# Altium schematic sheet yhh.SchDoc
size A3; DrawnBy: YHJ
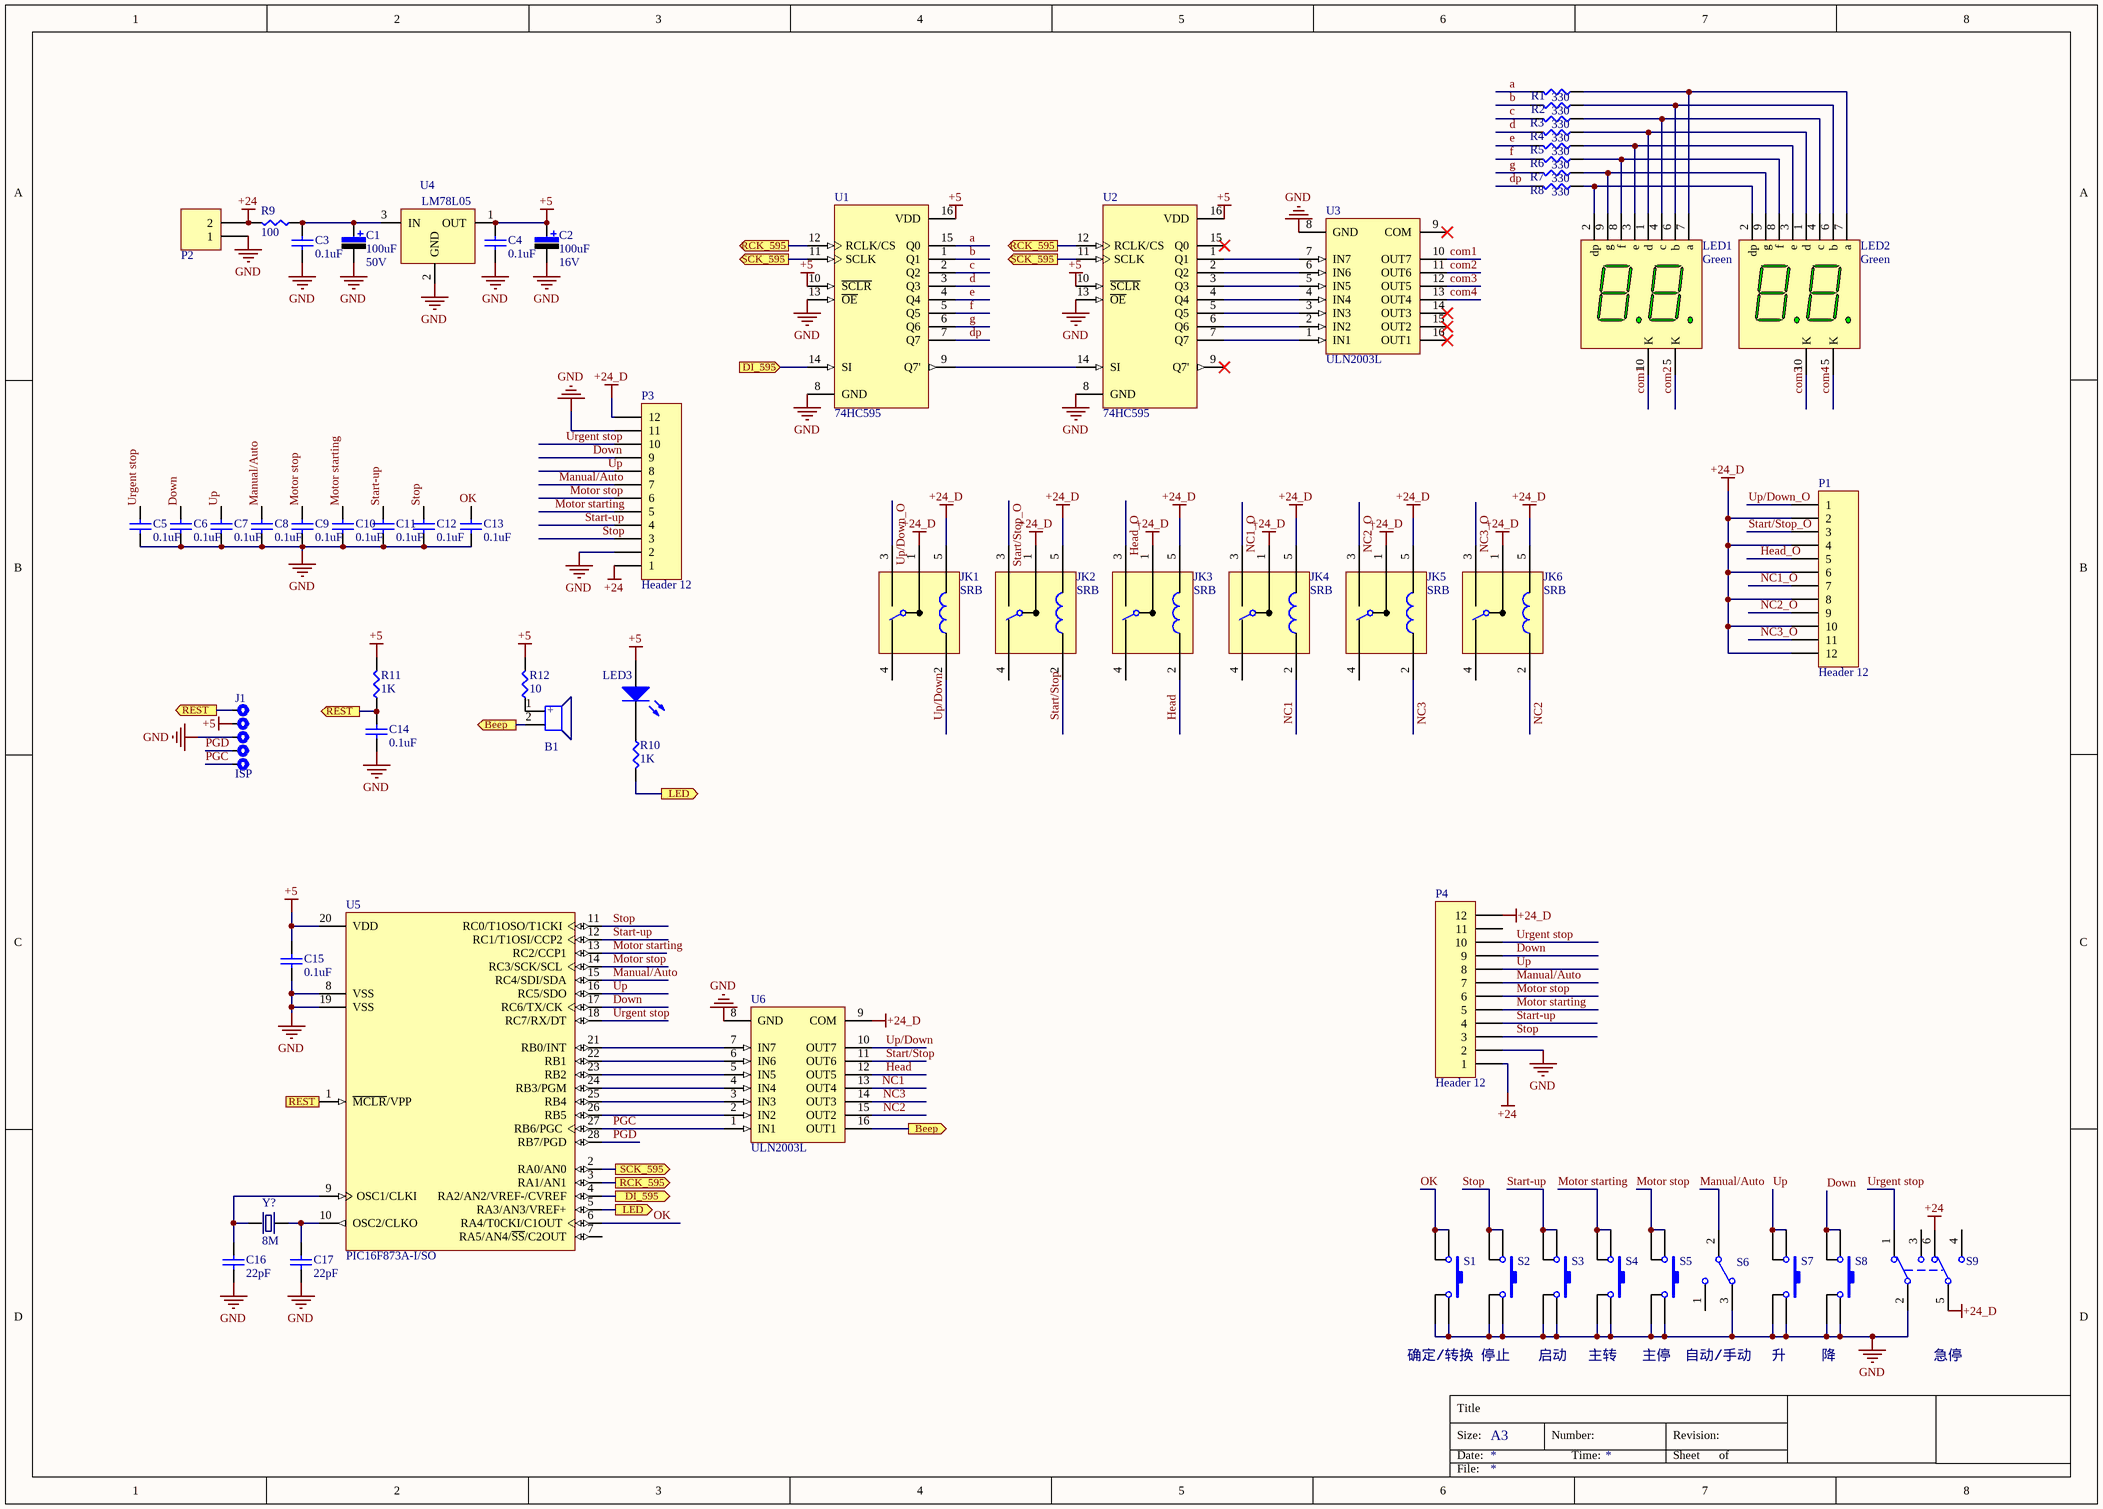
[diagram p0: yhh.SchDoc]

## Parts
B1  BEEP  [BUZZ]  (value not drawn)
C1  value 100uF  Vol: 50V  [CAL6.3x8]  (hidden comment: Cap Pol)
C2  value 100uF  Vol: 16V  [TA3216]  (hidden comment: Cap Pol)
C3  0.1uF  [C0805(2012)]
C4  0.1uF  [C0805(2012)]
C5  0.1uF  [C0805(2012)]
C6  0.1uF  [C0805(2012)]
C7  0.1uF  [C0805(2012)]
C8  0.1uF  [C0805(2012)]
C9  0.1uF  [C0805(2012)]
C10  0.1uF  [C0805(2012)]
C11  0.1uF  [C0805(2012)]
C12  0.1uF  [C0805(2012)]
C13  0.1uF  [C0805(2012)]
C14  0.1uF  [C0805(2012)]
C15  0.1uF  [C0805(2012)]
C16  22pF  [C0805(2012)]
C17  22pF  [C0805(2012)]
J1  ISP  [HDR1X6]
JK1  SRB  [RELAY_SRA]
JK2  SRB  [RELAY_SRA]
JK3  SRB  [RELAY_SRA]
JK4  SRB  [RELAY_SRA]
JK5  SRB  [RELAY_SRA]
JK6  SRB  [RELAY_SRA]
LED1  Green  [LED_KRS-8201CPG-3.5]
LED2  Green  [LED_KRS-8201CPG-3.5]
LED3  LED  [LED_0805]  (value not drawn)
P1  Header 12  [CON_DEGSON236_5_12P]
P2  Header 2  [HDR1X2]  (value not drawn)
P3  Header 12  [CON_DEGSON236_5_12P]
P4  Header 12
R1  330  [R0805(2012)]
R2  330  [R0805(2012)]
R3  330  [R0805(2012)]
R4  330  [R0805(2012)]
R5  330  [R0805(2012)]
R6  330  [R0805(2012)]
R7  330  [R0805(2012)]
R8  330  [R0805(2012)]
R9  100  [R1206(3216)]
R10  1K  [R0805(2012)]
R11  1K  [R0805(2012)]
R12  10  [R0805(2012)]
S1  SW-PB4  [KEY_6x6]  (value not drawn)
S2  SW-PB4  (value not drawn)
S3  SW-PB4  (value not drawn)
S4  SW-PB4  (value not drawn)
S5  SW-PB4  (value not drawn)
S6  SW-SPDT  (value not drawn)
S7  SW-PB4  (value not drawn)
S8  SW-PB4  (value not drawn)
S9  SW-DPDT  (value not drawn)
U1  74HC595  [SOP16]
U2  74HC595  [SOP16]
U3  ULN2003L  [SOP16]
U4  LM78L05  [SOT89_3L]
U5  PIC16F873A-I/SO  [SOP-28]
U6  ULN2003L  [SOP16]
Y?  8M  [X-HC49U]

## Ports
Beep (out), DI_595 (in), DI_595 (out), LED (out), RCK_595 (out), REST (out), SCK_595 (out)

## Nets
+5: C2.1 C4.1 C15.1 J1.2 LED3.1(A) R11.1 R12.1 U1.10(~{SCLR}) U1.16(VDD) U2.10(~{SCLR}) U2.16(VDD) U4.1(OUT) U5.20(VDD)
+24: P2.2 P3.1 P4.1 R9.1 S9.6
+24_D: JK1.1 JK1.5 JK2.1 JK2.5 JK3.1 JK3.5 JK4.1 JK4.5 JK5.1 JK5.5 JK6.1 JK6.5 P1.2 P1.4 P1.6 P1.8 P1.10 P1.12 P3.12 P4.12 S9.5 U6.9(COM)
GND: C1.2 C2.2 C3.2 C4.2 C5.1 C6.2 C7.1 C8.1 C9.2 C10.1 C11.2 C12.1 C13.2 C14.2 C15.2 C16.2 C17.2 J1.3 P2.1 P3.2 P3.11 P4.2 S1.2 S1.3 S2.2 S2.3 S3.2 S3.3 S4.2 S4.3 S5.2 S5.3 S6.3 S7.2 S7.3 S8.2 S8.3 S9.2 U1.8(GND) U1.13(~{OE}) U2.8(GND) U2.13(~{OE}) U3.8(GND) U4.2(GND) U5.8(VSS) U5.19(VSS) U6.8(GND)
a: R1.1 U1.15(Q0)
b: R2.1 U1.1(Q1)
Beep: B1.2(GND) U6.16(OUT1) ; port Beep
c: R3.1 U1.2(Q2)
com1: LED1.10(K) U3.10(OUT7)
com2: LED1.5(K) U3.11(OUT6)
com3: LED2.10(K) U3.12(OUT5)
com4: LED2.5(K) U3.13(OUT4)
d: R4.1 U1.3(Q3)
DI_595: U1.14(SI) U5.4(RA2/AN2/VREF-/CVREF) ; port DI_595
Down: C6.1 P3.9 P4.9 S8.1 S8.4 U5.17(RC6/TX/CK)
dp: R8.1 U1.7(Q7)
e: R5.1 U1.4(Q4)
f: R6.1 U1.5(Q5)
g: R7.1 U1.6(Q6)
Head: JK3.2 U6.12(OUT5)
Head_O: JK3.3 P1.5
LED: R10.1 U5.5(RA3/AN3/VREF+) ; port LED
Manual/Auto: C8.2 P3.7 P4.7 S6.2 U5.15(RC4/SDI/SDA)
Motor starting: C10.2 P3.5 P4.5 S4.1 S4.4 U5.13(RC2/CCP1)
Motor stop: C9.1 P3.6 P4.6 S5.1 S5.4 U5.14(RC3/SCK/SCL)
NC1: JK4.2 U6.13(OUT4)
NC1_O: JK4.3 P1.7
NC2: JK6.2 U6.15(OUT2)
NC2_O: JK5.3 P1.9
NC3: JK5.2 U6.14(OUT3)
NC3_O: JK6.3 P1.11
OK: S1.1 S1.4 U5.6(RA4/T0CKI/C1OUT)
PGC: J1.5 U5.27(RB6/PGC) U6.1(IN1)
PGD: J1.4 U5.28(RB7/PGD)
RCK_595: U1.12(RCLK/CS) U2.12(RCLK/CS) U5.3(RA1/AN1) ; port RCK_595
REST: C14.1 J1.1 R11.2 U5.1(~{MCLR}/VPP) ; port REST
SCK_595: U1.11(SCLK) U2.11(SCLK) U5.2(RA0/AN0) ; port SCK_595
Start-up: C11.1 P3.4 P4.4 S3.1 S3.4 U5.12(RC1/T1OSI/CCP2)
Start/Stop: JK2.2 U6.11(OUT6)
Start/Stop_O: JK2.3 P1.3
Stop: C12.2 P3.3 P4.3 S2.1 S2.4 U5.11(RC0/T1OSO/T1CKI)
Up: C7.2 P3.8 P4.8 S7.1 S7.4 U5.16(RC5/SDO)
Up/Down: JK1.2 U6.10(OUT7)
Up/Down_O: JK1.3 P1.1
Urgent stop: C5.2 P3.10 P4.10 S9.1 U5.18(RC7/RX/DT)
NetB1_1: B1.1(VCC) R12.2
NetC1_1: C1.1 C3.1 R9.2 U4.3(IN)
NetC16_1: C16.1 U5.9(OSC1/CLKI) Y?.2
NetC17_1: C17.1 U5.10(OSC2/CLKO) Y?.1
NetLED1_1: LED1.1(d) LED2.1(d) R4.2
NetLED1_2: LED1.2(dp) LED2.2(dp) R8.2
NetLED1_3: LED1.3(e) LED2.3(e) R5.2
NetLED1_4: LED1.4(c) LED2.4(c) R3.2
NetLED1_6: LED1.6(b) LED2.6(b) R2.2
NetLED1_7: LED1.7(a) LED2.7(a) R1.2
NetLED1_8: LED1.8(f) LED2.8(f) R6.2
NetLED1_9: LED1.9(g) LED2.9(g) R7.2
NetLED3_2: LED3.2(K) R10.2
NetU1_9: U1.9(Q7') U2.14(SI)
NetU2_1: U2.1(Q1) U3.7(IN7)
NetU2_2: U2.2(Q2) U3.6(IN6)
NetU2_3: U2.3(Q3) U3.5(IN5)
NetU2_4: U2.4(Q4) U3.4(IN4)
NetU2_5: U2.5(Q5) U3.3(IN3)
NetU2_6: U2.6(Q6) U3.2(IN2)
NetU2_7: U2.7(Q7) U3.1(IN1)
NetU5_21: U5.21(RB0/INT) U6.7(IN7)
NetU5_22: U5.22(RB1) U6.6(IN6)
NetU5_23: U5.23(RB2) U6.5(IN5)
NetU5_24: U5.24(RB3/PGM) U6.4(IN4)
NetU5_25: U5.25(RB4) U6.3(IN3)
NetU5_26: U5.26(RB5) U6.2(IN2)

Not connected (* = marked no-connect by the designer): C13 1; JK1 4; JK2 4; JK3 4; JK4 4; JK5 4; JK6 4; P4 11; S6 1; S9 3 4; U2 9(Q7')* 15(Q0)*; U3 9(COM)* 14(OUT3)* 15(OUT2)* 16(OUT1)*; U5 7(RA5/AN4/~{SS}/C2OUT)

## Notes on the sheet
- 确定/转换
- 停止
- 启动
- 主转
- 主停
- 自动/手动
- 升
- 降
- 急停
- Labels drawn without touching a wire or pin: OK
- Title
- Size:
- Date:
- A3
- Number:
- Time:
- Revision:
- Sheet
- of
- File:
- (in symbol BEEP) +

## Library data of the parts
C1 C2 = Cap Pol: 极性钽电容; Published: 8-Jun-2000; LatestRevisionDate: 17-Jul-2002; LatestRevisionNote: Re-released for DXP Platform.; PackageReference: RB7.6-15; Publisher: Altium Limited
C3-C17 = Cap: 无极性电容; Published: 8-Jun-2000; LatestRevisionDate: 17-Jul-2002; LatestRevisionNote: Re-released for DXP Platform.; Publisher: Altium Limited
J1 = ISP_5
JK1-JK6 = SRB: 单刀双掷继电器
LED1 LED2 = LED_KRS-8201CPG-3.5: 共阴1寸LED; dP段电压(10ｍA): 4V; 段电压(10ｍA): 7.7V; 段电压(14ｍA): 7.8; dP段电压(14ｍA): 4V
LED3 = LED: 发光二极管; Published: 8-Jun-2000; LatestRevisionDate: 08-Jul-2005; LatestRevisionNote: Mech Layer 1 removed.; PackageReference: LED-0; Publisher: Altium Limited
P1 P3 P4 = Header 12: Header, 12-Pin; LatestRevisionDate: 17-Jul-2002; LatestRevisionNote: Re-released for DXP Platform.; Publisher: Altium Limited
P2 = Header 2: 接插件; LatestRevisionDate: 17-Jul-2002; LatestRevisionNote: Re-released for DXP Platform.; Publisher: Altium Limited
R1-R12 = Res: Resistor; Published: 8-Jun-2000; LatestRevisionDate: 17-Jul-2002; Publisher: Altium Limited; PackageDescription: Axial Device, Thru-Hole; 2 Leads; 0.7 in Pin Spacing
S1-S5 S7 S8 = SW-PB4: 微动开关; Published: 24-Mar-1999; LatestRevisionDate: 17-Jul-2002; LatestRevisionNote: Re-released for DXP Platform.; PackageReference: SPST-2; Publisher: Altium Limited
S6 = SW-SPDT: 开关; Published: 24-Mar-1999; LatestRevisionDate: 17-Dec-2003; LatestRevisionNote: Schematic revised, PCB Footprint replaced.; PackageReference: TL36WW15050; Publisher: Altium Limited; DatasheetDocument: 05-Dec-2000; ComponentLink1Description: Manufacturer Link; ComponentLink1URL: http://www.apem.com
S9 = SW-DPDT: 单刀双掷开关; Published: 24-Mar-1999; LatestRevisionDate: 17-Jul-2002; LatestRevisionNote: Re-released for DXP Platform.; PackageReference: DPDT-6; Publisher: Altium Limited
U1 U2 = 74HC595: 移位寄存器; ComponentAvailability: Not for New Design; Published: 15-Apr-2002; LatestRevisionDate: 13-Apr-2006; LatestRevisionNote: IPC-7351 Footprint Added.; DatasheetVersion: 1997; PackageVersion: 1997; PackageReference: 966-01; Publisher: Altium Limited; PackageDescription: 16-Pin Small Outline Package 1.27 mm Pitch; ComponentLink1Description: Manufacturer Link; ComponentLink1URL: http://www.onsemi.com/; ComponentLink2Description: Datasheet; ComponentLink2URL: http://www.onsemi.com/pub/Collateral/MC74VHC595-D.PDF
U3 U6 = ULN2003L: 驱动芯片; Published: 13-Oct-2000; LatestRevisionDate: 13-Apr-2006; LatestRevisionNote: IPC-7351 Footprint Added.; DatasheetVersion: 1998; PackageReference: L16; Publisher: Altium Limited; PackageDescription: 16-Pin Small Outline Integrated Circuit 1.27 mm Pitch; Code_JEDEC: MS-012-AC; Code_IPC: SOIC127P600-16; ComponentLink1Description: Manufacturer Link; ComponentLink1URL: http://www.allegromicro.com/
U4 = LM78LXX
U5 = PIC16F873A-I/SO: Enhanced FLASH Microcontroller, 4K (x14-Bit words) FLASH, 192 Bytes RAM, 28-Pin SOIC, Standard VDD Range, Industrial Temperature; ComponentAvailability: Unknown. Contact manufacturer to determine status.; Published: 11-Oct-2004; LatestRevisionDate: 29-Jan-2009; LatestRevisionNote: Sch. layout revised. 3D Model Removed.; DatasheetVersion: revB, Oct-2003; PackageVersion: revBB, Aug-2009; PackageReference: SOIC-SO28; Publisher: Altium Limited; PackageDescription: 28-Lead Plastic Small Outline (SO) - Wide 7.50mm Body [SOIC]; Supplier 1: Digi-Key; Supplier Part Number 1: PIC16F873A-I/SO-ND; Supplier 2: Farnell; Supplier Part Number 2: 1660034; Supplier 3: Farnell; Supplier Part Number 3: 9761080; Code_JEDEC: MS-013; ComponentLink1Description: Datasheet; ComponentLink1URL: http://ww1.microchip.com/downloads/en/DeviceDoc/39582b.pdf; ComponentLink2Description: Packaging Specification; ComponentLink2URL: http://www.microchip.com/stellent/groups/techpub_sg/documents/packagingspec/en012702.pdf; ComponentLink3Description: Microchip.com Home; ComponentLink3URL: http://www.microchip.com/
Y? = Xtal